# EAGLE design Geiger_counter_HV_section (EAGLE 9.2.2)
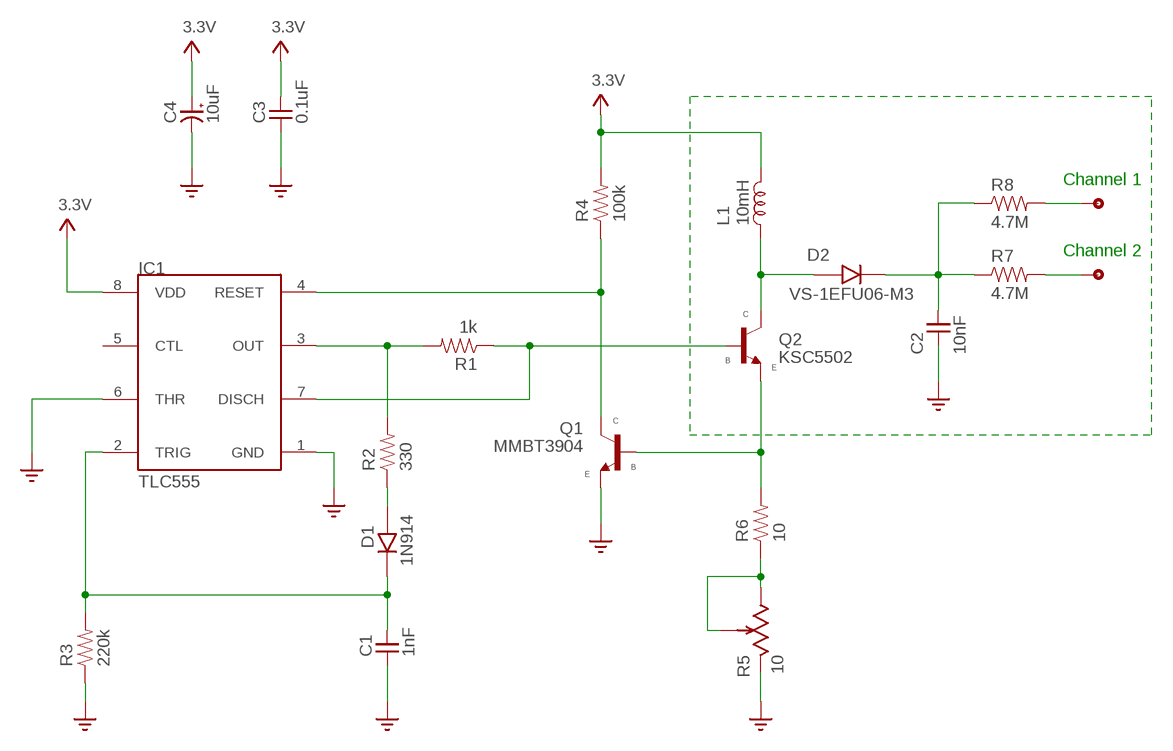
[diagram p0: schematic, sheet 1]

## Parts
C1  1nF  CAPACITOR0805  [0805]
C2  10nF  CAPACITOR1206  [1206]
C3  0.1uF  CAPACITOR0805  [0805]
C4  10uF  CAPACITOR+  [1206]
D1  1N914  DIODE0805  [0805]
D2  VS-1EFU06-M3  DIODE  [DO-219AB]
IC1  TLC555  TLC555SOIC-8  [SOIC8]
L1  10mH  INDUCTOR1200LRS  [1200LRS]
Q1  MMBT3904  [SOT-23A]
Q2  KSC5502  [TO-252]
R1  1k  RESISTORSMD0805  [0805]
R2  330  RESISTORSMD0805  [0805]
R3  220k  RESISTORSMD0805  [0805]
R4  100k  RESISTORSMD0805  [0805]
R5  10  TRIM_3362P  [3362P]
R6  10  RESISTORSMD1206  [1206]
R7  4.7M  RESISTORSMD1206  [1206]
R8  4.7M  RESISTORSMD1206  [1206]
TP1  TP  [TP]
TP2  TP  [TP]

## Nets
GND: C1.1 C2.1 C3.1 C4.2 IC1.1(GND) IC1.6(THR) Q1.3(E) R3.1 R5.P$3(P3) ; supply symbol labelled DGND
N$1: D1.1(A) R2.1
N$2: IC1.4(RESET) Q1.1(C) R4.1
N$3: IC1.3(OUT) R1.2 R2.2
N$4: R5.P$1(P1) R5.P$2(WIPE) R6.1
N$5: Q1.2(B) Q2.P$2(E) R6.2
N$6: C1.2 D1.2(K) IC1.2(TRIG) R3.2
N$7: IC1.7(DISCH) Q2.P$1(B) R1.1
N$8: C2.2 D2.P$2(K) R7.1 R8.1
N$9: R7.2 TP1.P$1
N$10: D2.P$1(A) L1.P1 Q2.P$3(C)
N$13: R8.2 TP2.P$1
VCC: C3.2 C4.1 IC1.8(VDD) L1.P3 R4.2 ; supply symbol labelled 3.3V
Unconnected: IC1.5(CTL)

## Notes on the sheet
- Channel 1
- Channel 2

## Library data of the parts
C1-C3 = thomas_library:CAPACITOR: This is a capacitor
C4 = thomas_library:CAPACITOR+: This is a polarized capacitor
D1 D2 = thomas_library:DIODE: This is a diode
IC1 = thomas_library:TLC555
L1 = thomas_library:INDUCTOR: This is an inductor
Q1 = thomas_library:MMBT3904: This is a SMT bipolar NPN transistor.
Q2 = thomas_library:KSC5502
R1-R4 R6-R8 = thomas_library:RESISTOR: This is a resistor
R5 = thomas_library:TRIM_3362P
TP1 TP2 = thomas_library:TP: A test point

## Board
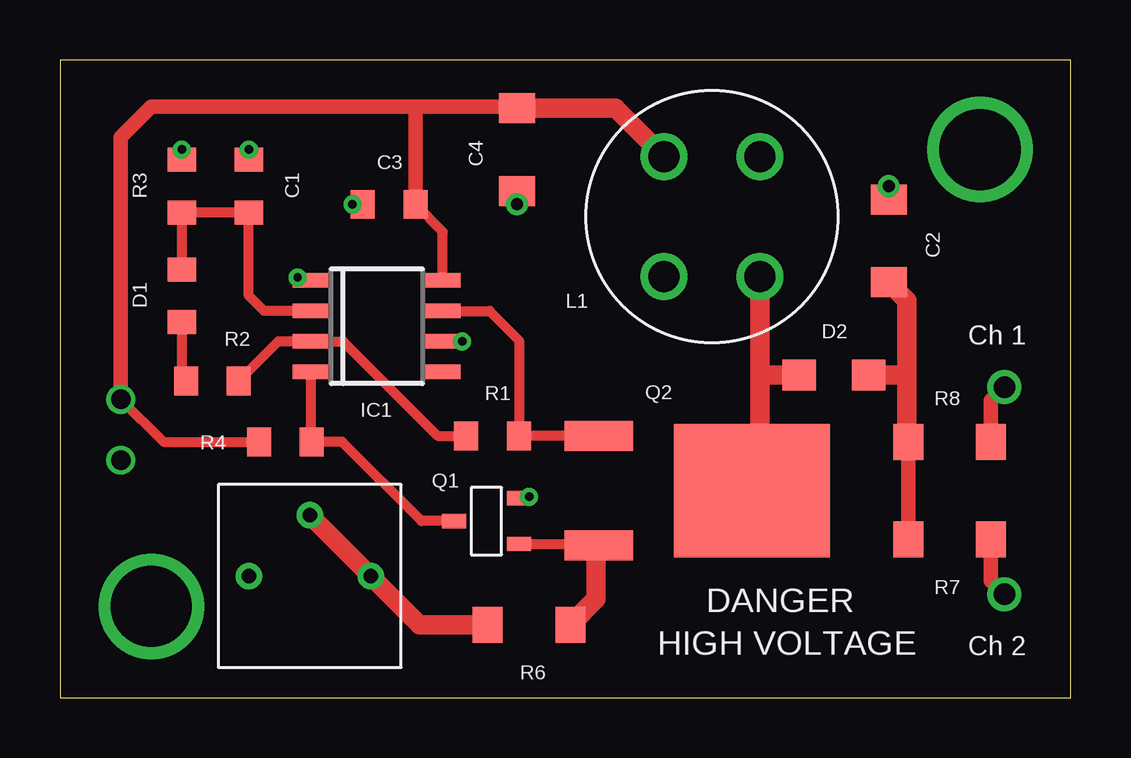
[diagram p1: board, top side]
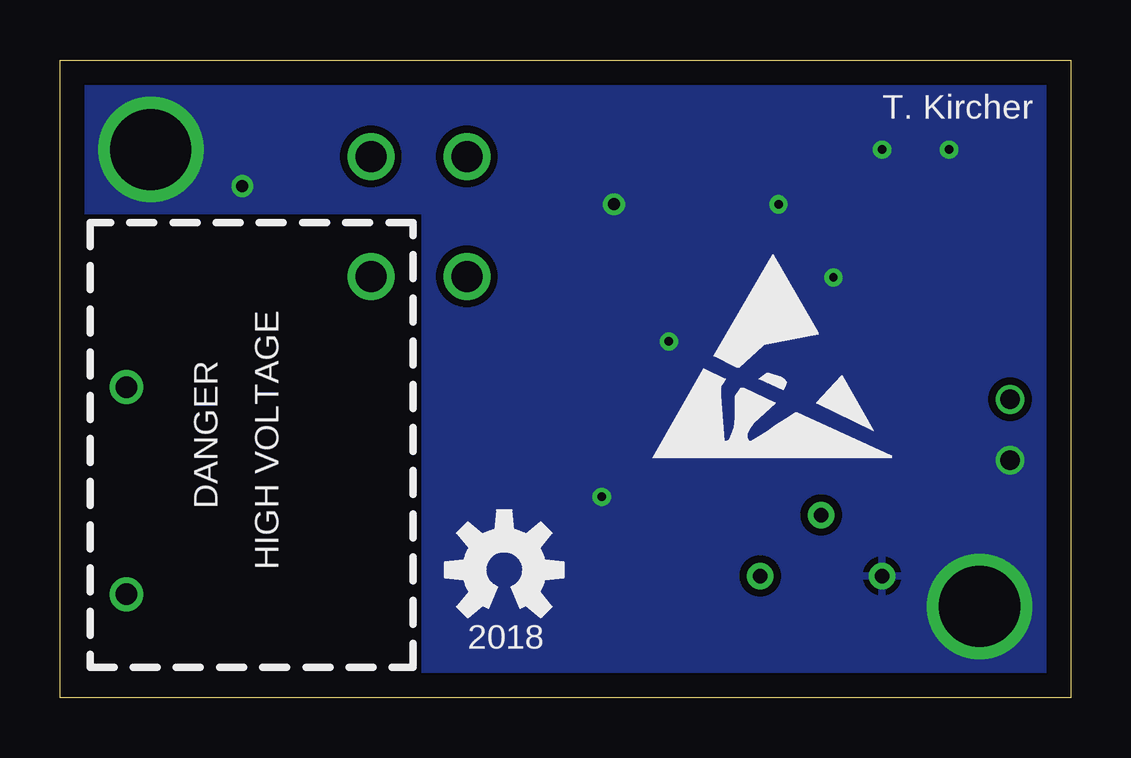
[diagram p2: board, bottom side, seen from below]

Size 42.14 x 26.59 mm. Coordinates in mm from the lower left corner, seen from the top.
Outline: 0,0 42.14,0 42.14,26.59 0,26.59 0,0
Copper layers (1*16): Top 0.035mm / dielectric 1.5mm / Bottom 0.035mm
Design rules "default": minimum track width 6mil, minimum drill 0.35mm, track to track 6mil, track to pad 6mil, pad to pad 6mil, via to via 6mil, smd to smd 6mil, copper to edge 40mil, drill to drill 6mil, minimum pad ring 10mil, minimum via ring 8mil, stop-mask expansion 4mil, vias tented up to drill 0mil, thermal gap 10mil

### Footprints (pad centres in the part's own frame; a part is rotated, then mirrored left to right if it is on the bottom)
0805 = smd 1 x 1.2: 1 -1.1,0; 2 1.1,0
1206 = smd 1.25 x 1.5: 1 -1.725,0; 2 1.725,0
DO-219AB = smd 1.397 x 1.295: P$1 -1.448,0; P$2 1.448,0
SOIC8 = smd 0.6 x 1.5: 1 -1.905,-2.75; 2 -0.635,-2.75; 3 0.635,-2.75; 4 1.905,-2.75; 5 1.905,2.75; 6 0.635,2.75; 7 -0.635,2.75; 8 -1.905,2.75
1200LRS = drill 1.3: P1 -2,2.5; P2 -2,-2.5; P3 2,-2.5; P4 2,2.5
SOT-23A = smd 0.6 x 1: 1 0,1.35; 2 -0.95,-1.35; 3 0.95,-1.35
TO-252 = smd 1.25 x 2.85: P$1 -2.28,-3.2; P$2 2.28,-3.2 | smd 5.55 x 6.5: P$3 0,3.2
3362P = drill 0.6: P$1 -2.54,0; P$2 0,-2.54; P$3 2.54,0
TP = drill 0.9: P$1 0,0

### Placement (x,y rotation side)
C1  7.87,21.34 270 top
C2  34.54,19.05 270 top
C3  13.72,20.57 0 top
C4  19.05,22.86 270 top
D1  5.08,16.76 90 top
D2  32.26,13.46 0 top
IC1  13.21,15.49 270 top
L1  27.18,20.07 180 top
Q1  17.78,7.37 90 top
Q2  25.65,8.64 270 top
R1  10k  [0805]  18.03,10.92 180 top
R2  6.35,13.21 0 top
R3  5.08,21.34 270 top
R4  9.4,10.67 180 top
R5  10.41,5.08 180 top
R6  19.56,3.05 0 top
R7  37.08,6.6 0 top
R8  37.08,10.67 0 top
TP1  39.37,4.32 0 top
TP2  39.37,12.95 0 top
U$14  [ESD_10.00]  17.53,9.91 0 bottom
U$15  [OSHW-LOGO-M]  23.62,5.33 0 bottom

### Tracks (layer width: path | path; a pad name or v marks a point on that pad's centre or on a via)
GND  (via drill 0.35, 0.5, 0.8, 3.38)
  Top 0.406: v12.19,20.57 C3.1 | IC1.1 9.91,17.4 v9.91,17.53 | R3.1 v5.08,22.86 | v7.87,22.86 C1.1 | v16.76,14.86 IC1.6 | Q1.3 19.2,8.38 v19.56,8.38
  Top 0.61: C4.2 v19.05,20.57 | v34.54,21.34 C2.1
  other vias: 2.54,9.91 38.35,22.86 3.81,3.81
  pour Bottom (isolate 0.305): 0,26.42 0,0 26.92,0 26.92,26.42
  pour Bottom (isolate 0.305): 26.92,26.42 41.91,26.42 41.91,20.32 26.92,20.32
N$1
  Top 0.406: D1.1 5.08,13.38 R2.1
N$2
  Top 0.406: IC1.4 10.46,10.71 R4.1 11.77,10.67 15.07,7.37 Q1.1
N$3
  Top 0.406: R1.2 15.75,10.92 11.81,14.86 IC1.3 9.1,14.86 R2.2
N$4
  Top 0.813: R5.P$2 R5.P$1 14.99,3.05 R6.1
N$5
  Top 0.406: Q1.2 22.39,6.42 Q2.P$2
  Top 0.813: R6.2 22.35,4.12 22.35,6.25 Q2.P$2
N$6
  Top 0.406: D1.2 R3.2 C1.2 7.87,16.76 8.51,16.13 IC1.2
N$7
  Top 0.406: IC1.7 17.91,16.13 19.13,14.9 R1.1 Q2.P$1
N$8
  Top 0.61: R8.1 R7.1
  Top 0.813: 35.31,13.46 35.31,10.72 R8.1 | C2.2 35.31,16.56 35.31,13.46 | D2.P$2 35.31,13.46
N$9
  Top 0.61: R7.2 38.81,4.88 TP1.P$1
N$10
  Top 0.813: Q2.P$3 29.18,8.96 29.18,13.46 | 29.18,13.46 L1.P1 | D2.P$1 29.18,13.46
N$13
  Top 0.61: R8.2 38.81,12.39 TP2.P$1
VCC  (via drill 0.8)
  Top 0.406: IC1.8 15.96,19.43 C3.2 | R4.2 4.32,10.67 v2.54,12.45
  Top 0.61: C3.2 14.82,24.64 | v2.54,12.45 2.54,23.37 3.81,24.64 14.82,24.64 | 14.82,24.64 19,24.64 C4.1
  Top 0.813: C4.1 23.16,24.59 L1.P3

### Text on the board
tNames: L1 | D2 | Ch 1 | Q2 | DANGER | HIGH VOLTAGE | Ch 2
bNames: T. Kircher | DANGER | HIGH VOLTAGE | 2018